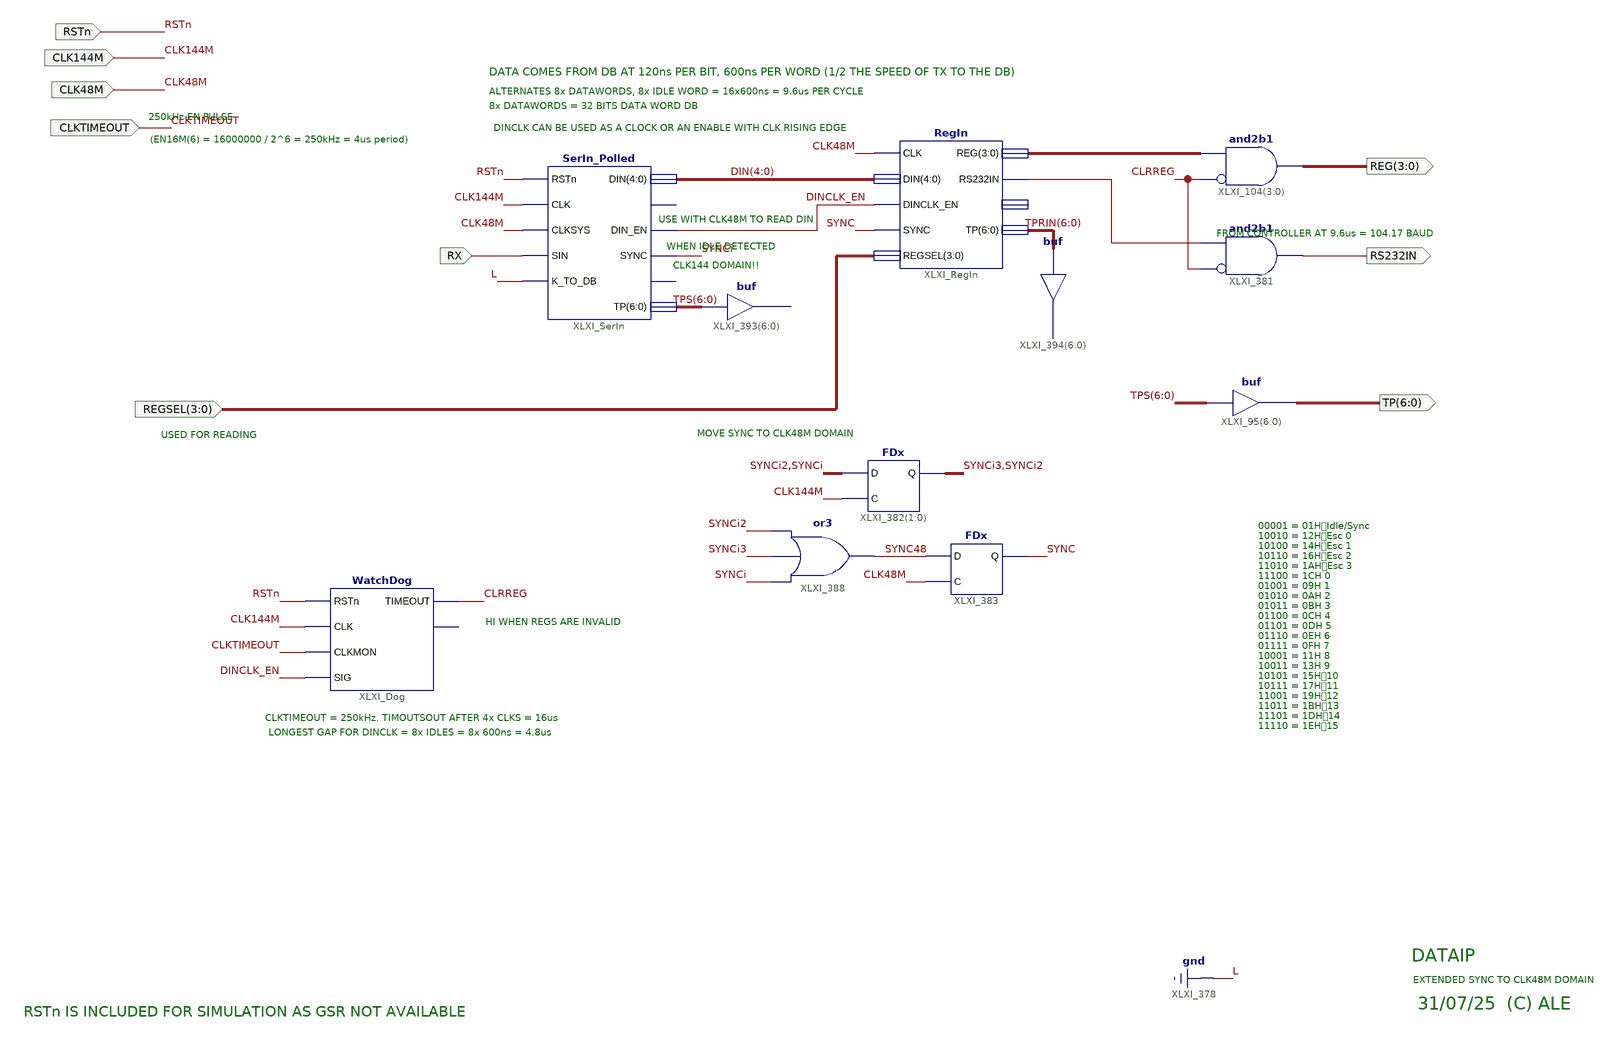
[diagram p0: schematic sheet 1]
// Xilinx ISE schematic DataIp.sch (spartan6) as structural Verilog: 11 symbols, 9 ports
module DataIp (
  input  CLK144M,
  input  RSTn,
  input  CLKTIMEOUT,
  input  [3:0] REGSEL,
  input  CLK48M,
  input  RX,
  output [3:0] REG,
  output [6:0] TP,
  output RS232IN
);

  wire CLRREG, DINCLK_EN, SYNC, SYNC48, SYNCi, SYNCi2, SYNCi3, XLXN_25;
  wire [3:0] XLXN_19;
  wire [4:0] DIN;
  wire [6:0] TPRIN, TPS;

  SerIn_Polled XLXI_SerIn (
    .CLK(CLK144M), .CLKSYS(CLK48M), .DIN(DIN), .DIN_EN(DINCLK_EN), .K_TO_DB(1'b0), .RSTn(RSTn), .SIN(RX),
    .SYNC(SYNCi), .TP(TPS));  // open: EDGE, ISDATA
  assign REG = ~{4{CLRREG}} & XLXN_19;  // and2b1 XLXI_104[3..0], 4 bits wide
  assign TP = TPS;  // buf XLXI_95[6..0], 7 bits wide
  and XLXI_381 (RS232IN, ~CLRREG, XLXN_25);  // and2b1
  RegIn XLXI_RegIn (
    .CLK(CLK48M), .DIN(DIN), .DINCLK_EN(DINCLK_EN), .REG(XLXN_19), .REGSEL(REGSEL), .RS232IN(XLXN_25),
    .SYNC(SYNC), .TP(TPRIN));  // open: VAL
  FDx XLXI_382[1:0] (.C(CLK144M), .D({SYNCi2, SYNCi}), .Q({SYNCi3, SYNCi2}));
  WatchDog XLXI_Dog (
    .CLK(CLK144M), .CLKMON(CLKTIMEOUT), .RSTn(RSTn), .SIG(DINCLK_EN), .TIMEOUT(CLRREG));  // open: DETECT
  FDx XLXI_383 (.C(CLK48M), .D(SYNC48), .Q(SYNC));
  or XLXI_388 (SYNC48, SYNCi, SYNCi3, SYNCi2);
  // buf XLXI_393[6..0] has open pins: I=TPS, O=open
  // buf XLXI_394[6..0] has open pins: I=TPRIN, O=open

  // Notes on the sheet:
  //   DATA COMES FROM DB AT 120ns PER BIT, 600ns PER WORD (1/2 THE SPEED OF TX TO THE DB)
  //   ALTERNATES 8x DATAWORDS, 8x IDLE WORD = 16x600ns = 9.6us PER CYCLE
  //   8x DATAWORDS = 32 BITS DATA WORD DB
  //   250kHz EN PULSE
  //   DINCLK CAN BE USED AS A CLOCK OR AN ENABLE WITH CLK RISING EDGE
  //   (EN16M(6) = 16000000 / 2^6 = 250kHz = 4us period)
  //   USE WITH CLK48M TO READ DIN
  //   FROM CONTROLLER AT 9.6us = 104.17 BAUD
  //   WHEN IDLE DETECTED
  //   CLK144 DOMAIN!!
  //   MOVE SYNC TO CLK48M DOMAIN
  //   USED FOR READING
  //   00001 = 01H	Idle/Sync
  //   10010 = 12H	Esc 0
  //   10100 = 14H	Esc 1
  //   10110 = 16H	Esc 2
  //   11010 = 1AH	Esc 3
  //   11100 = 1CH 0
  //   01001 = 09H 1
  //   01010 = 0AH 2
  //   01011 = 0BH 3
  //   01100 = 0CH 4
  //   HI WHEN REGS ARE INVALID
  //   01101 = 0DH 5
  //   01110 = 0EH 6
  //   01111 = 0FH 7
  //   10001 = 11H 8
  //   10011 = 13H 9
  //   10101 = 15H	10
  //   10111 = 17H	11
  //   11001 = 19H	12
  //   11011 = 1BH	13
  //   11101 = 1DH	14
  //   CLKTIMEOUT = 250kHz. TIMOUTSOUT AFTER 4x CLKS = 16us
  //   11110 = 1EH	15
  //   LONGEST GAP FOR DINCLK = 8x IDLES = 8x 600ns = 4.8us
  //   DATAIP
  //   EXTENDED SYNC TO CLK48M DOMAIN
  //   31/07/25  (C) ALE
  //   RSTn IS INCLUDED FOR SIMULATION AS GSR NOT AVAILABLE
endmodule
